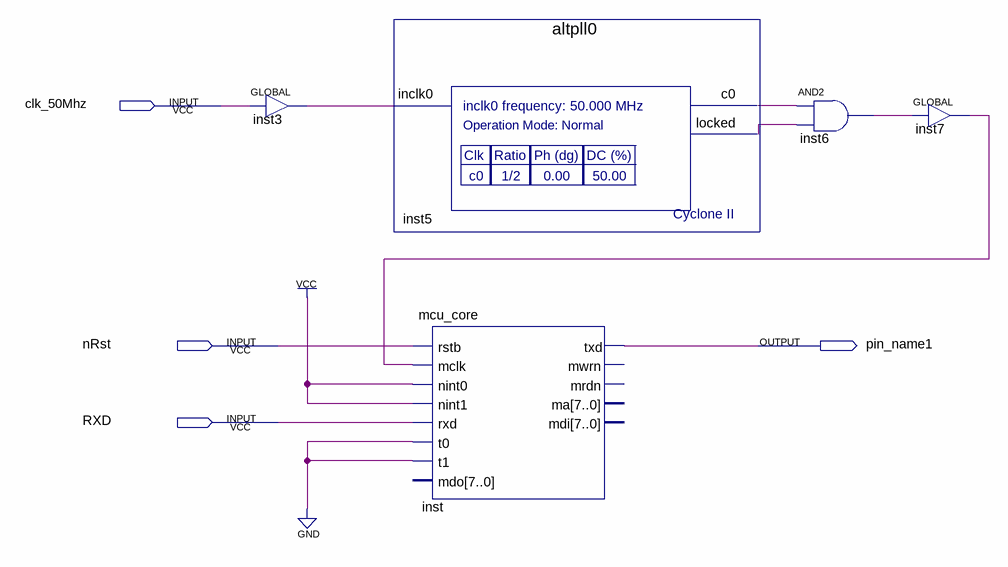
[diagram p0: schematic sheet]
// Quartus schematic MCU_8051.bdf as structural Verilog: 5 symbols, 4 pins
module MCU_8051 (
  input  clk_50Mhz,
  input  nRst,
  input  RXD,
  output pin_name1
);

  wire inst3_out, inst5_c0, inst5_locked, inst6_out, inst7_out;

  GLOBAL inst3 (.IN(clk_50Mhz), .OUT(inst3_out));
  altpll0 inst5 (.inclk0(inst3_out), .c0(inst5_c0), .locked(inst5_locked));
  mcu_core inst (
    .rstb(nRst), .mclk(inst7_out), .nint0(1'b1), .nint1(1'b1), .rxd(RXD), .t0(1'b0), .t1(1'b0),
    .txd(pin_name1));  // open: mdo, mwrn, mrdn, ma, mdi
  and inst6 (inst6_out, inst5_c0, inst5_locked);
  GLOBAL inst7 (.IN(inst6_out), .OUT(inst7_out));
endmodule
